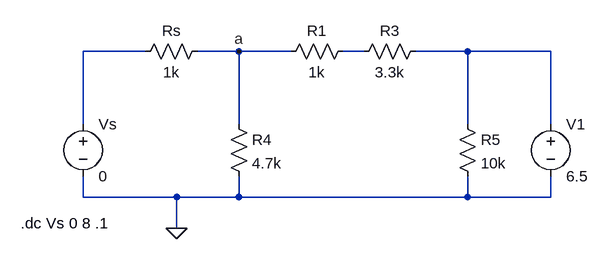
[diagram p0: schematic Lab05Circuit03.asc]
Lab05Circuit03.asc, the LTspice schematic file:
Version 4
SHEET 1 880 680
WIRE 144 16 48 16
WIRE 288 16 224 16
WIRE 368 16 288 16
WIRE 480 16 448 16
WIRE 640 16 560 16
WIRE 768 16 640 16
WIRE 48 128 48 16
WIRE 288 128 288 16
WIRE 640 128 640 16
WIRE 768 128 768 16
WIRE 48 240 48 208
WIRE 192 240 48 240
WIRE 288 240 288 208
WIRE 288 240 192 240
WIRE 640 240 640 208
WIRE 640 240 288 240
WIRE 768 240 768 208
WIRE 768 240 640 240
WIRE 192 288 192 240
FLAG 192 288 0
FLAG 288 16 a
SYMBOL voltage 48 112 R0
WINDOW 123 0 0 Left 0
WINDOW 39 0 0 Left 0
SYMATTR InstName Vs
SYMATTR Value 0
SYMBOL voltage 768 112 R0
WINDOW 123 0 0 Left 0
WINDOW 39 0 0 Left 0
SYMATTR InstName V1
SYMATTR Value 6.5
SYMBOL res 128 32 R270
WINDOW 0 32 56 VTop 2
WINDOW 3 0 56 VBottom 2
SYMATTR InstName Rs
SYMATTR Value 1k
SYMBOL res 352 32 R270
WINDOW 0 32 56 VTop 2
WINDOW 3 0 56 VBottom 2
SYMATTR InstName R1
SYMATTR Value 1k
SYMBOL res 272 112 R0
SYMATTR InstName R4
SYMATTR Value 4.7k
SYMBOL res 624 112 R0
SYMATTR InstName R5
SYMATTR Value 10k
SYMBOL res 464 32 R270
WINDOW 0 32 56 VTop 2
WINDOW 3 0 56 VBottom 2
SYMATTR InstName R3
SYMATTR Value 3.3k
TEXT -48 280 Left 2 !.dc Vs 0 8 .1

The netlist it stands for:
* Lab05Circuit03.asc
Vs N001 0 0
V1 N003 0 6.5
Rs N001 a 1k
R1 a N002 1k
R4 a 0 4.7k
R5 N003 0 10k
R3 N002 N003 3.3k
.dc Vs 0 8 .1
.backanno
.end